# Altium schematic sheet oled.SchDoc
size A3
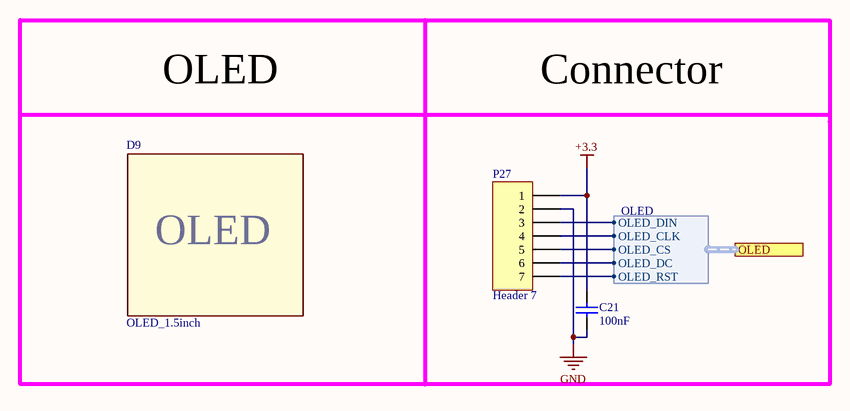
[diagram p0: oled.SchDoc]

## Parts
C21  100nF  [CAP_0402i_1005m -N]
D9  OLED_1.5inch  [oled_1.5inch]
P27  Header 7  [HDR1X7]

## Blocks framed on the sheet
OLED: D9

## Ports
OLED (harness OLED)

## Harnesses
OLED: OLED_DIN, OLED_CLK, OLED_CS, OLED_DC, OLED_RST

## Nets
+3.3: C21.1 P27.1
GND: C21.2 P27.2
NetP27_3: P27.3 ; port OLED.OLED_DIN
NetP27_4: P27.4 ; port OLED.OLED_CLK
NetP27_5: P27.5 ; port OLED.OLED_CS
NetP27_6: P27.6 ; port OLED.OLED_DC
NetP27_7: P27.7 ; port OLED.OLED_RST

## Notes on the sheet
- Connector
- 1
- 2
- 3
- 4
- 5
- 6
- 7
- 8
- A
- B
- C
- D
- Project:
- Date:
- Drawing number:
- Rev:
- Format:
- A3
- Drawn by:
- Laboratory:
- Page
- Sheet:
- of
- File:
- (in symbol OLED_1.5inch) OLED

## Library data of the parts
C21 = Cap: capacitor
D9 = OLED_1.5inch: 128x128 1.5inch RGB OLED Display Modul SPI
P27 = Header 7: Header, 7-Pin